# Altium project Styx plus.PrjPcb
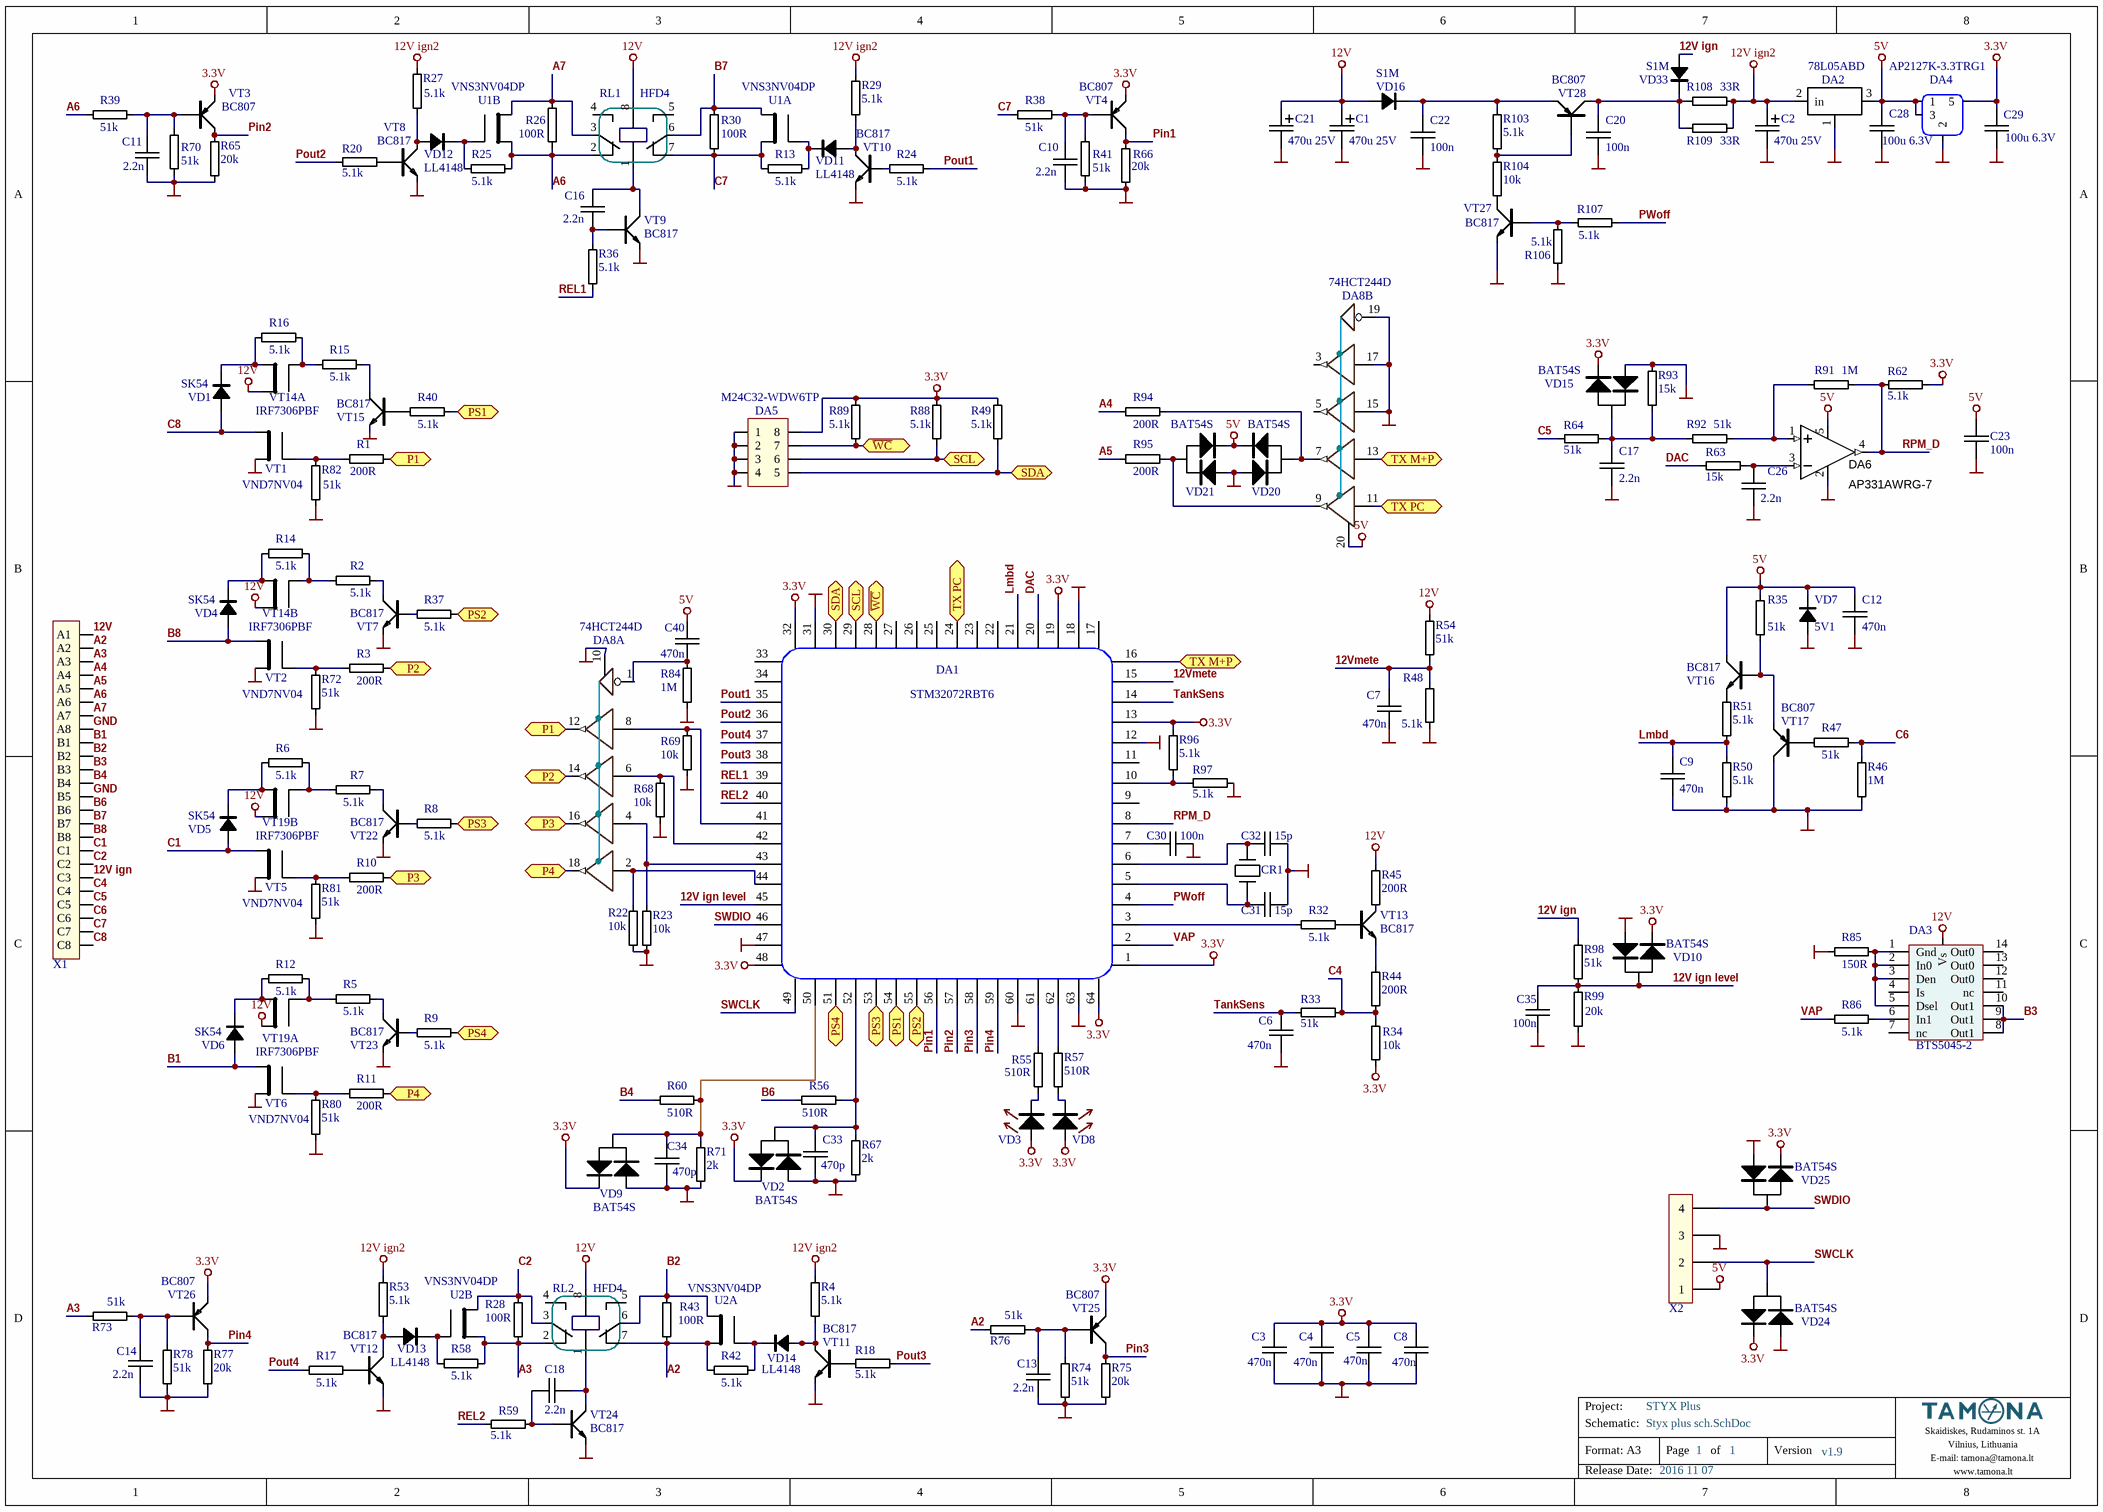
[diagram p0: Styx plus sch.SchDoc]
1 sheet, 188 parts. Net scope: flat (ports and power ports of the same name join across sheets).
Board files: Styx plus pcb.PcbDoc, Styx plus panele.PcbDoc

## Sheet Styx plus sch.SchDoc
size A3; DocumentNumber: 1; SheetNumber: 1; SheetTotal: 1; PageSetup: Record=PageOptionsÞCenterHorizontal=TrueÞCenterVertical=TrueÞPrintScale=1.00ÞXCorrection=1.00ÞYCorrection=1.00ÞPrintKind=1ÞBorderSize=5000000ÞLeftOffset=0ÞBottomOffset=0ÞOrientation=2ÞPaperLength=1000ÞPaperWidth=1000ÞScale=100ÞPaperSource=7ÞPrintQuality=-4ÞMediaType=1ÞDitherType=10ÞPaperKind=A5ÞPrintScaleMode=0; Version: v1.9; Project: STYX Plus; ReleaseDate: 2016 11 07

### Parts
C1  470u 25V  [C Elektr 10mm+]
C2  470u 25V  [C Elektr 10mm+]
C3  470n  [0805 st]
C4  470n  [0805 st]
C5  470n  [0805 st]
C6  470n  [0805 st]
C7  470n  [0805 st]
C8  470n  [0805 st]
C9  470n  [0805 st]
C10  2.2n  [0805 st]
C11  2.2n  [0805 st]
C12  470n  [0805 st]
C13  2.2n  [0805 st]
C14  2.2n  [0805 st]
C16  2.2n  [0805 st]
C17  2.2n  [0805 st]
C18  2.2n  [0805 st]
C20  100n  [0805 st]
C21  470u 25V  [C Elektr 10mm+]
C22  100n  [0805 st]
C23  100n  [0805 st]
C26  2.2n  [0805 st]
C28  100u 6.3V  [1206 st]
C29  100u 6.3V  [1206 st]
C30  100n  [0805 st]
C31  15p  [0805 st]  (no BOM)
C32  15p  [0805 st]  (no BOM)
C33  470p  [0805 st]
C34  470p  [0805 st]
C35  100n  [0805 st]
C40  470n  [0805 st]
CR1  CRYSTAL-GENERIC  [CRYSTAL_HC49-US-SM]  (value not drawn)  (no BOM)
DA1  STM32072RBT6  [TQFP64]
DA2  78L05ABD  [SOP8  L78L00]
DA3  BTS5045-2  [SO14 with  pad]
DA4  AP2127K-3.3TRG1  [SOT23-5]
DA5  M24C32-WDW6TP  [TSSOP8]
DA6  AP331AWRG-7  [SOT23-5]
DA8  74HCT244D  [SO20]  (parts A,B of 2)
R1  200R  [0805 W]
R2  5.1k  [0805 W]
R3  200R  [0805 W]
R4  5.1k  [0805 W]
R5  5.1k  [0805 W]
R6  5.1k  [0805 W]
R7  5.1k  [0805 W]
R8  5.1k  [0805 W]
R9  5.1k  [0805 W]
R10  200R  [0805 W]
R11  200R  [0805 W]
R12  5.1k  [0805 W]
R13  5.1k  [0805 W]
R14  5.1k  [0805 W]
R15  5.1k  [0805 W]
R16  5.1k  [0805 W]
R17  5.1k  [0805 W]
R18  5.1k  [0805 W]
R20  5.1k  [0805 W]
R22  10k  [0805 W]
R23  10k  [0805 W]
R24  5.1k  [0805 W]
R25  5.1k  [0805 W]
R26  100R  [2512]
R27  5.1k  [0805 W]
R28  100R  [2512]
R29  5.1k  [0805 W]
R30  100R  [2512]
R32  5.1k  [0805 W]
R33  51k  [0805 W]
R34  10k  [0805 W]
R35  51k  [0805 W]
R36  5.1k  [0805 W]
R37  5.1k  [0805 W]
R38  51k  [0805 W]
R39  51k  [0805 W]
R40  5.1k  [0805 W]
R41  51k  [0805 W]
R42  5.1k  [0805 W]
R43  100R  [2512]
R44  200R  [1206 W]
R45  200R  [1206 W]
R46  1M  [0805 W]
R47  51k  [0805 W]
R48  5.1k  [0805 W]
R49  5.1k  [0805 W]
R50  5.1k  [0805 W]
R51  5.1k  [0805 W]
R53  5.1k  [0805 W]
R54  51k  [0805 W]
R55  510R  [0805 W]  (no BOM)
R56  510R  [0805 W]
R57  510R  [0805 W]  (no BOM)
R58  5.1k  [0805 W]
R59  5.1k  [0805 W]
R60  510R  [0805 W]
R62  5.1k  [0805 W]
R63  15k  [0805 W]
R64  51k  [0805 W]
R65  20k  [0805 W]
R66  20k  [0805 W]
R67  2k  [0805 W]
R68  10k  [0805 W]
R69  10k  [0805 W]
R70  51k  [0805 W]
R71  2k  [0805 W]
R72  51k  [0805 W]
R73  51k  [0805 W]
R74  51k  [0805 W]
R75  20k  [0805 W]
R76  51k  [0805 W]
R77  20k  [0805 W]
R78  51k  [0805 W]
R80  51k  [0805 W]
R81  51k  [0805 W]
R82  51k  [0805 W]
R84  1M  [0805 W]
R85  150R  [0805 W]
R86  5.1k  [0805 W]
R88  5.1k  [0805 W]
R89  5.1k  [0805 W]
R91  1M  [0805 W]
R92  51k  [0805 W]
R93  15k  [0805 W]
R94  200R  [0805 W]
R95  200R  [0805 W]
R96  5.1k  [0805 W]
R97  5.1k  [0805 W]  (no BOM)
R98  51k  [0805 W]
R99  20k  [0805 W]
R103  5.1k  [0805 W]
R104  10k  [0805 W]
R106  5.1k  [0805 W]
R107  5.1k  [0805 W]
R108  33R  [1206 W]
R109  33R  [1206 W]
RL1  HFD4  [RELE HFD4]
RL2  HFD4  [RELE HFD4]
TamonaLogo  LOGO  [TamonaLogo5]  (value not drawn)  (no BOM)
U1  VNS3NV04DP  [SOP8 2xMosfet]  (parts A,B of 2)
U2  VNS3NV04DP  [SOP8 2xMosfet]  (parts A,B of 2)
VD1  SK54  [Diodas STP]
VD2  BAT54S  [SOT23-123]
VD3  LED  [0805 Diode]  (value not drawn)  (no BOM)
VD4  SK54  [Diodas STP]
VD5  SK54  [Diodas STP]
VD6  SK54  [Diodas STP]
VD7  5V1  [Diode SOD80N]
VD8  LED  [0805 Diode]  (value not drawn)  (no BOM)
VD9  BAT54S  [SOT23-123]
VD10  BAT54S  [SOT23-123]
VD11  LL4148  [Diode SOD80N]
VD12  LL4148  [Diode SOD80N]
VD13  LL4148  [Diode SOD80N]
VD14  LL4148  [Diode SOD80N]
VD15  BAT54S  [SOT23-123]
VD16  S1M  [DO-214]
VD20  BAT54S  [SOT23-123]
VD21  BAT54S  [SOT23-123]
VD24  BAT54S  [SOT23-123]
VD25  BAT54S  [SOT23-123]
VD33  S1M  [DO-214]
VT1  VND7NV04  [DPAK]
VT2  VND7NV04  [DPAK]
VT3  BC807  [SOT23-BCE]
VT4  BC807  [SOT23-BCE]
VT5  VND7NV04  [DPAK]
VT6  VND7NV04  [DPAK]
VT7  BC817  [SOT23-BCE]
VT8  BC817  [SOT23-BCE]
VT9  BC817  [SOT23-BCE]
VT10  BC817  [SOT23-BCE]
VT11  BC817  [SOT23-BCE]
VT12  BC817  [SOT23-BCE]
VT13  BC817  [SOT23-BCE]
VT14  IRF7306PBF  [SOP8 2xMosfet]  (parts A,B of 2)
VT15  BC817  [SOT23-BCE]
VT16  BC817  [SOT23-BCE]
VT17  BC807  [SOT23-BCE]
VT19  IRF7306PBF  [SOP8 2xMosfet]  (parts A,B of 2)
VT22  BC817  [SOT23-BCE]
VT23  BC817  [SOT23-BCE]
VT24  BC817  [SOT23-BCE]
VT25  BC807  [SOT23-BCE]
VT26  BC807  [SOT23-BCE]
VT27  BC817  [SOT23-BCE]
VT28  BC807  [SOT23-BCE]
X1  X  [Conector 3x8]  (value not drawn)
X2  4x2.54  [JUNG 4x2.54]  (value not drawn)  (no BOM)

### Ports
P1, P2, P3, P4, PS1, PS2, PS3, PS4, SCL, SDA, TX M+P, TX PC, ~{WC}

### Nets
3.3V: C3.2 C4.2 C5.2 C8.2 C29.1 DA1.1 DA1.13 DA1.19 DA1.32 DA1.48 DA1.64 DA4.5 DA5.8 R34.2 R49.1 R62.2 R88.1 R89.1 R96.1 VD2.2 VD3.A VD8.A VD9.2 VD10.2 VD15.2 VD24.2 VD25.2 VT3.E VT4.E VT25.E VT26.E
5V: C12.1 C23.2 C28.1 C40.2 DA2.3(out) DA4.1 DA4.3 DA6.5(V+) DA8.20(VCC) R35.1 VD7.K VD20.2 VD21.2 VT16.C X2.1
12V: C1.+ C21.+ DA3.15(Vs) R45.1 R54.2 RL1.8 RL2.8 VD16.A VT14.5 VT14.7 VT19.5 VT19.7 X1.A1
12V ign2: C2.+ DA2.2(in) R4.2 R27.2 R29.2 R53.2 R108.2 R109.2
GND: C1.- C2.- C3.1 C4.1 C5.1 C6.2 C7.1 C8.1 C9.2 C10.2 C11.2 C12.2 C13.2 C14.2 C17.2 C20.2 C21.- C22.1 C23.1 C26.2 C28.2 C29.2 C30.2 C31.2 C32.2 C33.1 C34.1 C35.2 DA1.12 DA1.18 DA1.31 DA1.47 DA1.60 DA1.63 DA2.1(gnd) DA4.2 DA5.1 DA5.2 DA5.3 DA5.4 DA6.2(V-) DA8.10(GND) DA8.15 DA8.17 DA8.19 R22.1 R23.1 R41.1 R46.2 R48.2 R50.2 R65.2 R66.2 R67.1 R68.2 R69.2 R70.2 R71.1 R72.1 R74.2 R75.2 R77.2 R78.2 R80.1 R81.1 R82.2 R84.1 R85.1 R93.2 R97.2 R99.2 R106.1 VD2.1 VD7.A VD9.1 VD10.1 VD15.1 VD20.1 VD21.1 VD24.1 VD25.1 VT1.3(S) VT2.3(S) VT5.3(S) VT6.3(S) VT7.E VT8.E VT9.E VT10.E VT11.E VT12.E VT15.E VT17.C VT22.E VT23.E VT24.E VT27.E X1.A8 X1.B5 X2.3
12V ign: R98.1 VD33.A X1.C3
12V ign level: C35.1 DA1.45 R98.2 R99.1 VD10.3
12Vmete: C7.2 DA1.15 R48.1 R54.1
A2: R42.2 R43.2 R76.1 RL2.7 U2.1 X1.A2
A3: R28.2 R58.1 R73.1 RL2.2 U2.3 X1.A3
A4: R94.1 X1.A4
A5: R95.1 X1.A5
A6: R25.2 R26.2 R39.1 RL1.2 U1.3 X1.A6
A7: R26.1 RL1.3 U1.5 X1.A7
B1: VD6.A VT6.2(D) X1.B1
B2: R43.1 RL2.6 U2.7 X1.B2
B3: DA3.8(Out1) DA3.9(Out1) DA3.10(Out1) X1.B3
B4: R60.2 X1.B4
B6: R56.2 X1.B6
B7: R30.1 RL1.6 U1.7 X1.B7
B8: VD4.A VT2.2(D) X1.B8
C1: VD5.A VT5.2(D) X1.C1
C2: R28.1 RL2.3 U2.5 X1.C2
C4: R33.1 R34.1 R44.2 X1.C4
C5: R64.2 X1.C5
C6: R46.1 R47.2 X1.C6
C7: R13.1 R30.2 R38.1 RL1.7 U1.1 X1.C7
C8: VD1.A VT1.2(D) X1.C8
DAC: DA1.20 R63.2
Lmbd: C9.1 DA1.21 R50.1 R51.2
Pin1: DA1.56 R66.1 VT4.C
Pin2: DA1.57 R65.1 VT3.C
Pin3: DA1.58 R75.1 VT25.C
Pin4: DA1.59 R77.1 VT26.C
Pout1: DA1.35 R24.2
Pout2: DA1.36 R20.2
Pout3: DA1.38 R18.2
Pout4: DA1.37 R17.2
PWoff: DA1.4 R107.1
REL1: DA1.39 R36.2
REL2: DA1.40 R59.2
RPM_D: DA1.8 DA6.4(OUT) R62.1 R91.1
SWCLK: DA1.49 VD24.3 X2.2
SWDIO: DA1.46 VD25.3 X2.4
TankSens: C6.1 DA1.14 R33.2
VAP: DA1.2 R86.1
NetC10_1: C10.1 R38.2 R41.2 VT4.B
NetC11_1: C11.1 R39.2 R70.1 VT3.B
NetC13_1: C13.1 R74.1 R76.2 VT25.B
NetC14_1: C14.1 R73.2 R78.1 VT26.B
NetC16_1: C16.1 RL1.1 VT9.C
NetC16_2: C16.2 R36.1 VT9.B
NetC17_1: C17.1 R64.1 R92.1 R93.1 VD15.3
NetC18_1: C18.1 R59.1 VT24.B
NetC18_2: C18.2 RL2.1 VT24.C
NetC20_1: C20.1 R108.1 R109.1 VD33.K VT28.C
NetC22_2: C22.2 R103.2 VD16.K VT28.E
NetC26_1: C26.1 DA6.3(IN-) R63.1
NetC30_1: C30.1 DA1.7
NetC31_1: C31.1 CR1.1 DA1.5
NetC32_1: C32.1 CR1.2 DA1.6
NetC33_2: C33.2 DA1.52 R56.1 R67.2 VD2.3
NetC34_2: C34.2 DA1.50 R60.1 R71.2 VD9.3
NetC40_1: C40.1 DA8.1 R84.2
NetDA1_3: DA1.3 R32.1
NetDA1_10: DA1.10 R96.2 R97.1
NetDA1_16: DA1.16 DA8.13 ; port TX M+P
NetDA1_24: DA1.24 DA8.11 ; port TX PC
NetDA1_28: DA1.28 DA5.7 R89.2 ; port ~{WC}
NetDA1_29: DA1.29 DA5.6 R88.2 ; port SCL
NetDA1_30: DA1.30 DA5.5 R49.2 ; port SDA
NetDA1_41: DA1.41 DA8.8 R69.1
NetDA1_42: DA1.42 DA8.6 R68.1
NetDA1_43: DA1.43 DA8.4 R23.2
NetDA1_44: DA1.44 DA8.2 R22.2
NetDA1_51: DA1.51 R9.2 ; port PS4
NetDA1_53: DA1.53 R8.2 ; port PS3
NetDA1_54: DA1.54 R40.2 ; port PS1
NetDA1_55: DA1.55 R37.2 ; port PS2
NetDA1_61: DA1.61 R55.1
NetDA1_62: DA1.62 R57.1
NetDA3_1: DA3.1(Gnd) DA3.2(In0) DA3.3(Den) DA3.5(Dsel) R85.2
NetDA3_6: DA3.6(In1) R86.2
NetDA6_1: DA6.1(IN+) R91.2 R92.2
NetDA8_7: DA8.7 R94.2 VD20.3
NetDA8_9: DA8.9 R95.2 VD21.3
NetDA8_12: DA8.12 R1.2 ; port P1
NetDA8_14: DA8.14 R3.2 ; port P2
NetDA8_16: DA8.16 R10.2 ; port P3
NetDA8_18: DA8.18 R11.2 ; port P4
NetR1_1: R1.1 R82.1 VT1.1(G)
NetR2_1: R2.1 R14.2 VT14.4
NetR2_2: R2.2 VT7.C
NetR3_1: R3.1 R72.2 VT2.1(G)
NetR4_1: R4.1 VD14.A VT11.C
NetR5_1: R5.1 R12.2 VT19.2
NetR5_2: R5.2 VT23.C
NetR6_1: R6.1 VD5.K VT19.3
NetR6_2: R6.2 R7.1 VT19.4
NetR7_2: R7.2 VT22.C
NetR8_1: R8.1 VT22.B
NetR9_1: R9.1 VT23.B
NetR10_1: R10.1 R81.2 VT5.1(G)
NetR11_1: R11.1 R80.2 VT6.1(G)
NetR12_1: R12.1 VD6.K VT19.1
NetR13_2: R13.2 U1.2 VD11.K
NetR14_1: R14.1 VD4.K VT14.3
NetR15_1: R15.1 R16.2 VT14.2
NetR15_2: R15.2 VT15.C
NetR16_1: R16.1 VD1.K VT14.1
NetR17_1: R17.1 VT12.B
NetR18_1: R18.1 VT11.B
NetR20_1: R20.1 VT8.B
NetR24_1: R24.1 VT10.B
NetR25_1: R25.1 U1.4 VD12.K
NetR27_1: R27.1 VD12.A VT8.C
NetR29_1: R29.1 VD11.A VT10.C
NetR32_2: R32.2 VT13.B
NetR35_2: R35.2 VT16.B VT17.E
NetR37_1: R37.1 VT7.B
NetR40_1: R40.1 VT15.B
NetR42_1: R42.1 U2.2 VD14.K
NetR44_1: R44.1 VT13.E
NetR45_2: R45.2 VT13.C
NetR47_1: R47.1 VT17.B
NetR51_1: R51.1 VT16.E
NetR53_1: R53.1 VD13.A VT12.C
NetR55_2: R55.2 VD3.K
NetR57_2: R57.2 VD8.K
NetR58_2: R58.2 U2.4 VD13.K
NetR103_1: R103.1 R104.2 VT28.B
NetR104_1: R104.1 VT27.C
NetR106_2: R106.2 R107.2 VT27.B

Not connected (* = marked no-connect by the designer): DA1 9 11 17 22 23 25 26 27 33 34; DA3 4(Is) 7(nc) 11(nc) 12(Out0) 13(Out0) 14(Out0); DA8 3 5; RL1 4 5; RL2 4 5

### Notes on the sheet
- Project:
- Schematic:
- Format: A3
- Page       of
- Version
- Skaidiskes, Rudaminos st. 1A
- E-mail: tamona@tamona.lt
- Vilnius, Lithuania
- Release Date:
- www.tamona.lt

### Library data of the parts
C1 C2 C21 = C-SMD+: Kondensatorius elekt. SMD; Footprintas: 10 mm
C3-C14 C16-C18 C20 C22 C23 C26 C28-C35 C40 = C-SMD: Kondensatorius SMD
  C3-C14 C16-C18 C20 C22 C23 C26 C30-C35 C40: Footprintas: 0805
  C28 C29: Footprintas: 1206
CR1 = CRYSTAL-GENERIC: Kvarcinis rezonatorius; Footprintas: TH; Pitch: 4.88 mm
DA1 = 64-pin TQFP: Mikrovaldiklis; Footprintas: TQFP-64
DA2 = L78L00: Įtampos stabilizatorius; Footprintas: SOP-8
DA3 = BTS5045-2: Mikroschema; Footprintas: SO-14
DA4 = LDO 23-5: Įtampos stablizatorius; Footprintas: SOT-23-5
DA5 = SOP8: Atminties mikroschema; Footprintas: TSSOP-8
DA6 = Comparator: Operacinis stiprintuvas; Footprintas: SOT-23-5
DA8 = 74ABT244: Loginis buferis; Footprintas: SO-20
R1-R18 R20 R22-R30 R32-R51 R53-R60 R62-R78 R80-R82 R84-R86 R88 R89 R91-R99 R103 R104 R106-R109 = R-SMD: Rezistorius SMD
  R1-R18 R20 R22-R25 R27 R29 R32-R42 R46-R51 R53-R60 R62-R78 R80-R82 R84-R86 R88 R89 R91-R99 R103 R104 R106 R107: Footprintas: 0805
  R26 R28 R30 R43: Footprintas: 2512
  R44 R45 R108 R109: Footprintas: 1206
RL1 RL2 = RELAY HFD4: Rele SMD; Footprintas: SMT
TamonaLogo = Logo: Tamona Logo; Aprasymas: ?????; Uzsakymo Nr.: LEMONA; Aprasymas1: ?; Aprasymas2: ?; Aprasymas3: ?; Aprasymas4: ?; Aprasymas5: ?; Nominalas: ?; Pavadinimas: LOGO
U1 U2 VT14 VT19 = 2xMOSFET SO8: Tranzistorius; Footprintas: SOP-8
VD1 VD4-VD6 VD11-VD14 VD16 VD33 = DIODE SOD 80: Diodas
  VD1 VD4-VD6: Footprintas: SMB
  VD11-VD14: Footprintas: SOD-80
  VD16 VD33: Footprintas: DO-214
VD2 VD9 VD10 VD15 VD20 VD21 VD24 VD25 = DIODE-DUAL: Diodas; Footprintas: SOT-23
VD3 = LED: Sviesos diodas; Footprintas: 0805
VD7 = DIODE SOD 80: Stabilitronas; Footprintas: SOD-80
VD8 = LED: Diodas; Footprintas: 0805
VT1 VT2 VT5 VT6 = MOSFET: Tranzistorius; Footprintas: DPAK
VT3 VT4 VT17 VT25 VT26 VT28 = PNP-GENERIC: Tranzistorius; Footprintas: SOT-23
VT7-VT13 VT15 VT16 VT22-VT24 VT27 = NPN-GENERIC: Tranzistorius; Footprintas: SOT-23
X1 = Conector 3x8: Jungtis; Footprintas: TH; 3x8p; Pitch: 4.15 mm 3.33 mm
X2 = 4x2.54: Jungtis; Footprintas: 4x2.54 mm

## Assembly variants
Variant of DUJA: not fitted C31 C32 CR1 R55 R57 R97 VD3 VD8 X2